# EAGLE schematic output (EAGLE 6.6.0)
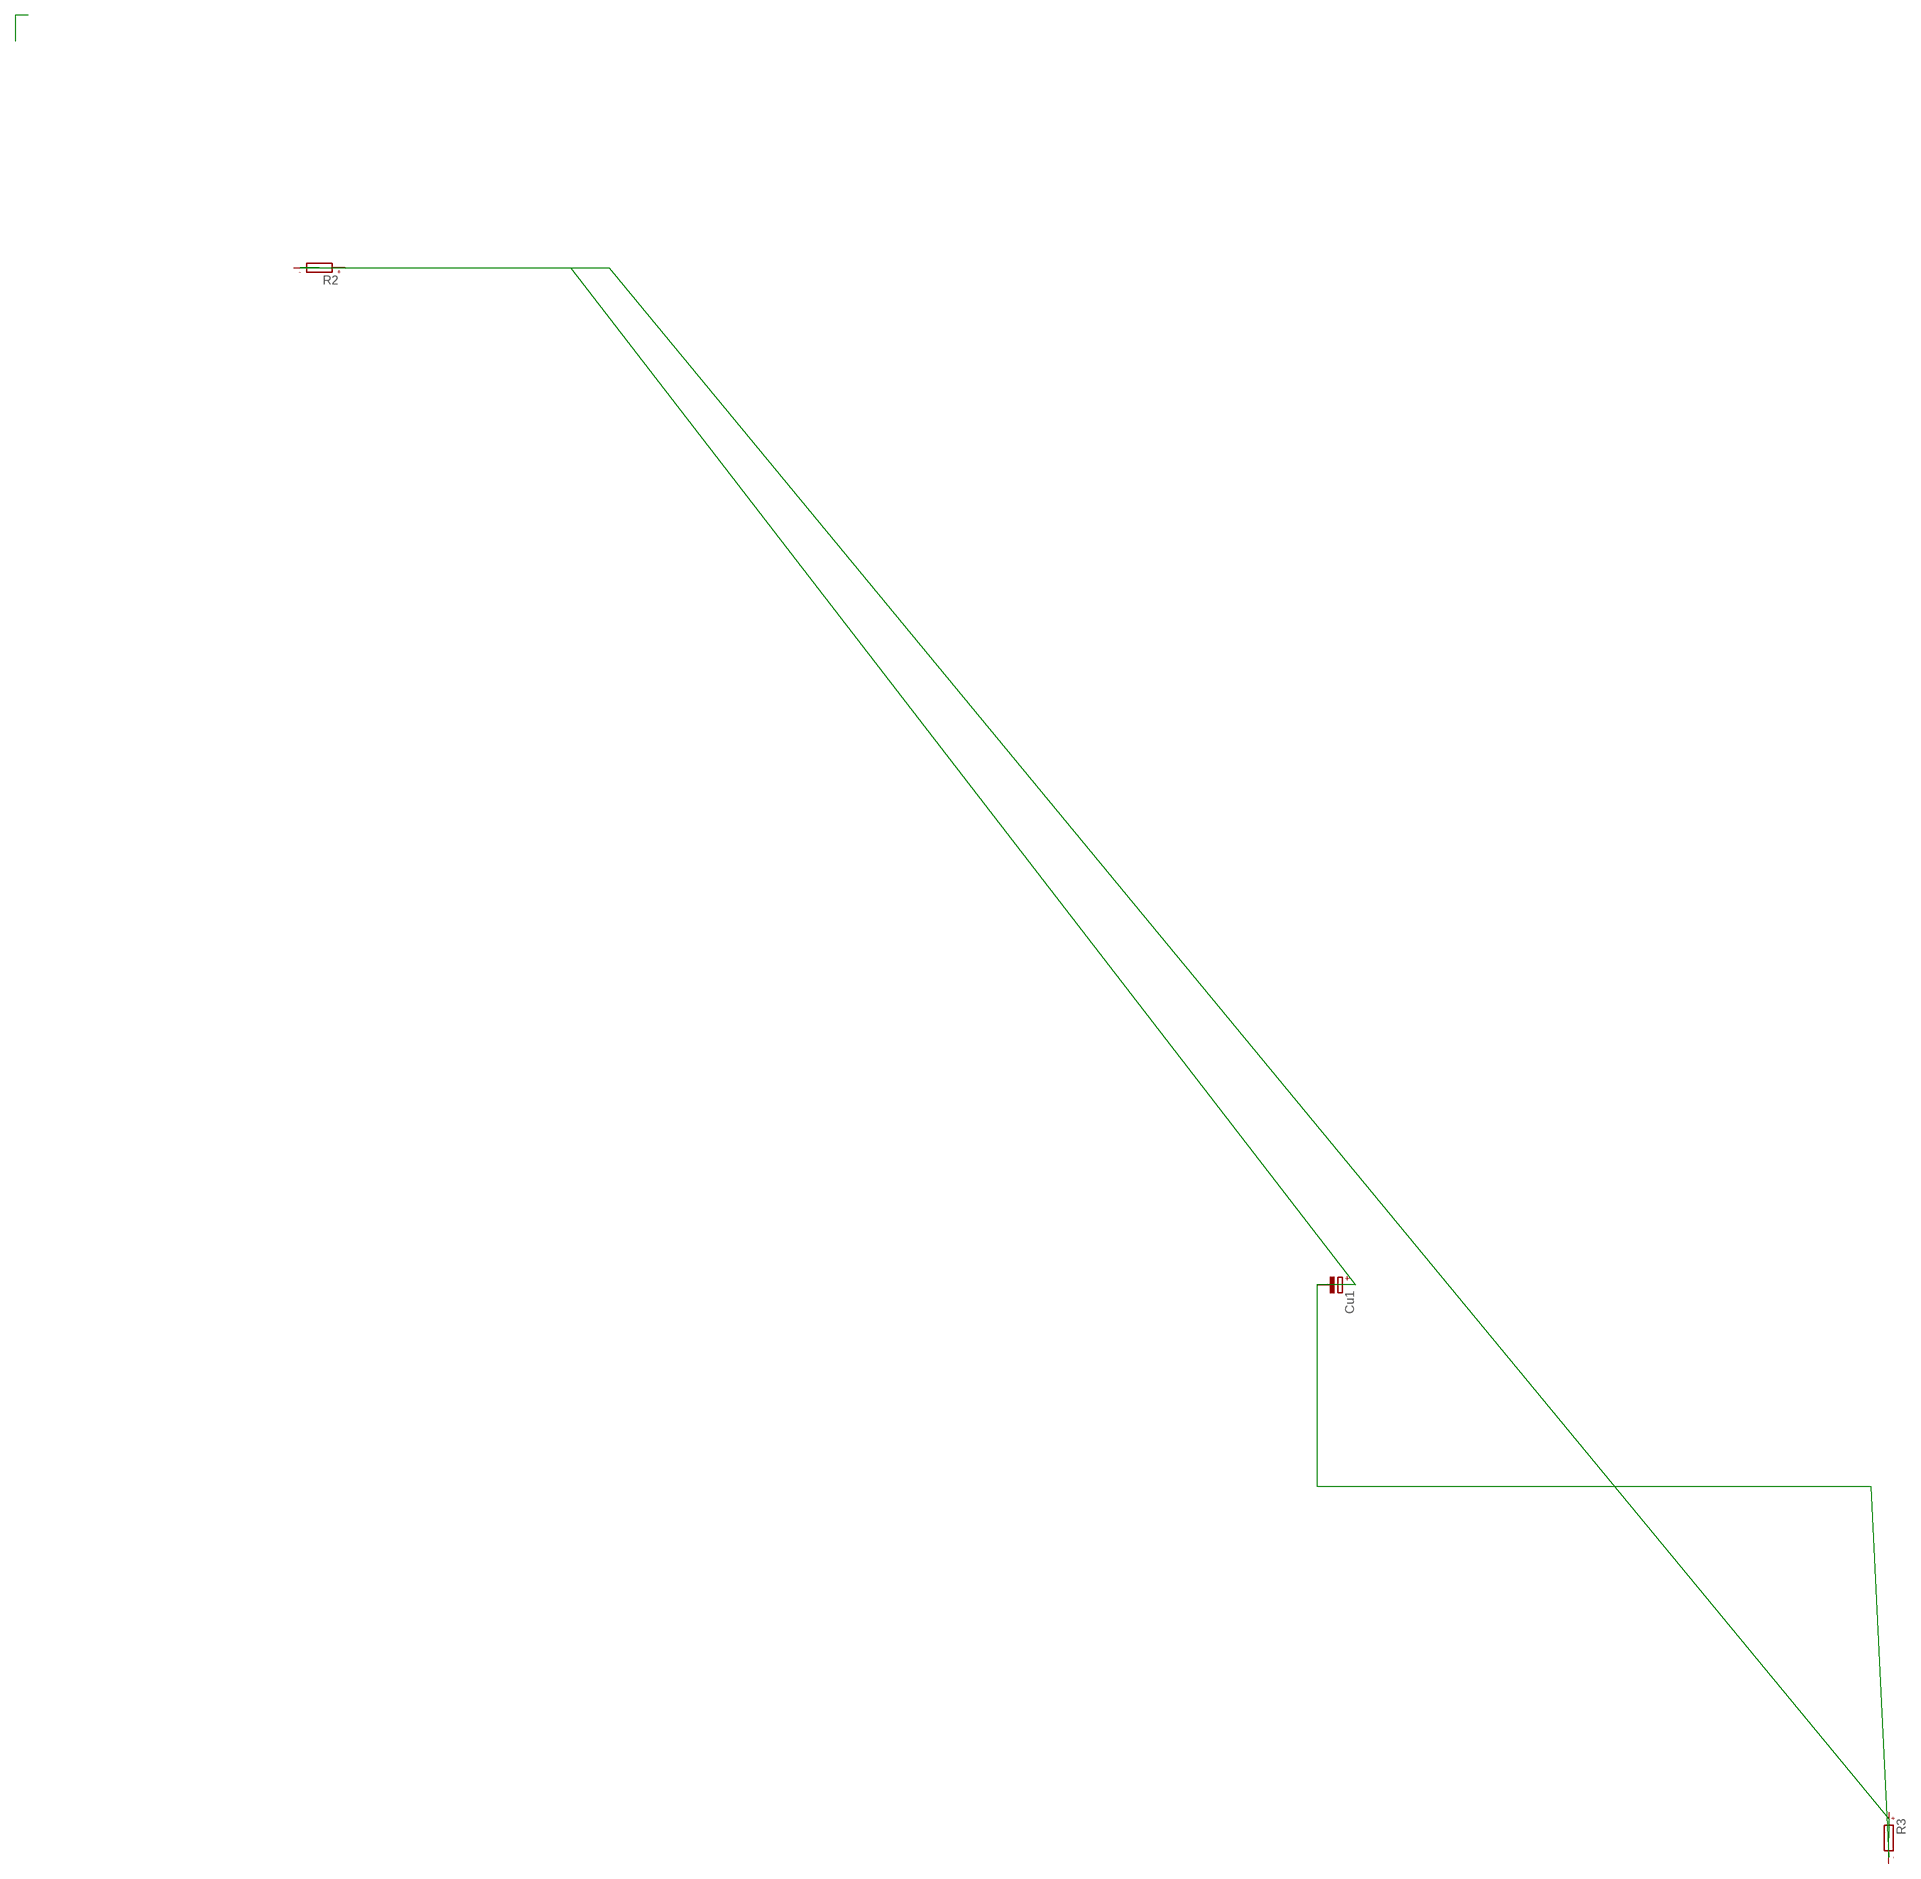
[diagram p0: schematic, sheet 1]

## Parts
Cu1  CPOL-EU085CS-1AR  [085CS_1AR]
R2  R-EU_0204/5  [0204/5]
R3  R-EU_0204/5  [0204/5]
Unconnected: Cu1.+ Cu1.- R2.1 R2.2 R3.1 R3.2

## Library data of the parts
Cu1 = rcl:CPOL-EU: POLARIZED CAPACITOR, European symbol; VITRUV_ID: 1
R2 R3 = rcl:R-EU_: RESISTOR, European symbol; VITRUV_ID: 0